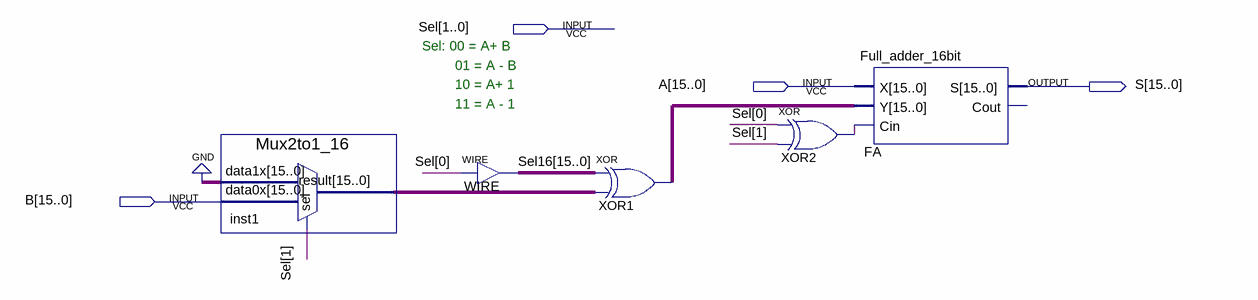
[diagram p0: schematic sheet]
// Quartus schematic ALU1.bdf as structural Verilog: 5 symbols, 4 pins
module ALU1 (
  input  [1:0] Sel,
  input  [15:0] A,
  input  [15:0] B,
  output [15:0] S
);

  wire XOR2_out;
  wire [15:0] inst1_result, Sel16, XOR1_out;

  Mux2to1_16 inst1 (.data1x({16{1'b0}}), .data0x(B), .sel(Sel[1]), .result(inst1_result));
  assign Sel16 = {16{Sel[0]}};  // WIRE WIRE
  assign XOR1_out = Sel16 ^ inst1_result;  // XOR XOR1, 16 bits wide
  xor XOR2 (XOR2_out, Sel[0], Sel[1]);
  Full_adder_16bit FA (.X(A), .Y(XOR1_out), .Cin(XOR2_out), .S(S));  // open: Cout

  // Notes on the sheet:
  //   Sel: 00 = A+ B  
  //    01 = A - B 
  //    10 = A+ 1
  //    11 = A - 1
endmodule
